# Altium schematic sheet Connector.SchDoc
size A4; SheetNumber: 3; SheetTotal: 3
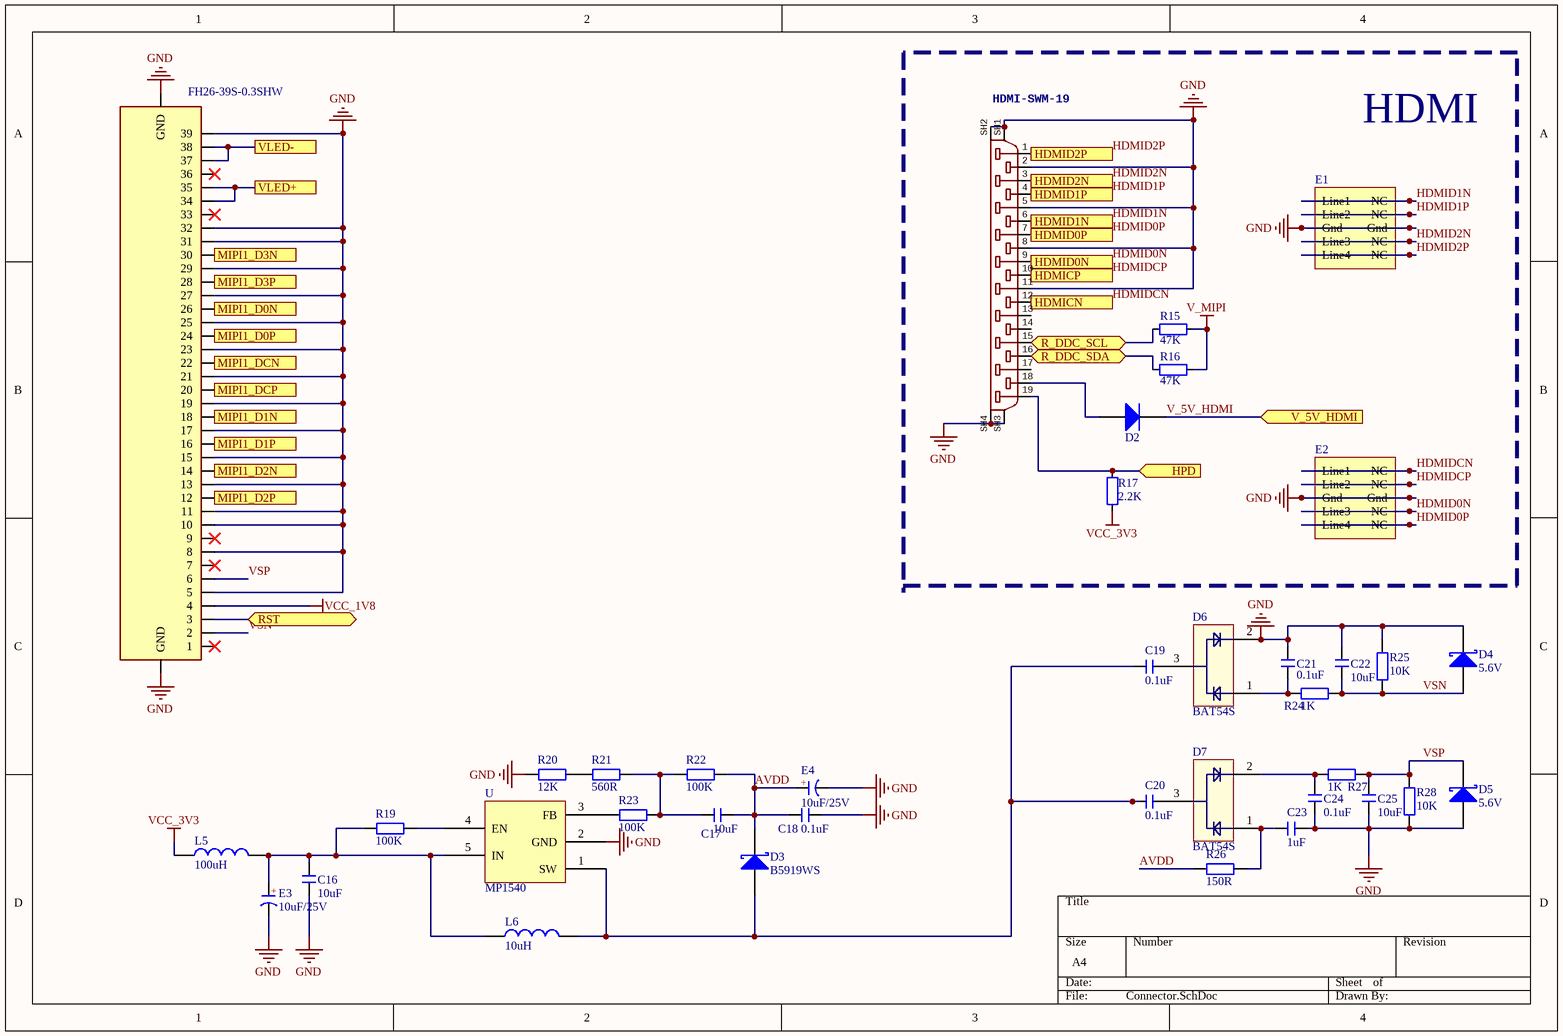
[diagram p0: Connector.SchDoc]

## Parts
2  FH26-39S-0.3SHW  [FH26-39S-0.3SHW]
C16  10uF  [C 0402_L]
C17  10uF  [C 0402_L]
C18  0.1uF  [C 0402_L]
C19  0.1uF  [C 0402_L]
C20  0.1uF  [C 0402_L]
C21  0.1uF  [C 0402_L]
C22  10uF  [C 0402_L]
C23  1uF  [C 0402_L]
C24  0.1uF  [C 0402_L]
C25  10uF  [C 0402_L]
D2  二极管-5B5817WS  [SOD-323]  (value not drawn)
D3  B5919WS  [DIODE-SMB]
D4  5.6V  [SOD-323]
D5  5.6V  [SOD-323]
D6  BAT54S  [SOT23]
D7  BAT54S  [SOT23]
E1  E?  [DFN-2510]  (value not drawn)
E2  E?  [DFN-2510]  (value not drawn)
E3  10uF/25V  [CD A(3216)]
E4  10uF/25V  [CD A(3216)]
HDMI?  HDMI-SWM-19  [HDMI-SWM-19]
L5  100uH  [L 0805]
L6  10uH  [L 0805]
R15  47K  [RES_0402]
R16  47K  [RES_0402]
R17  2.2K  [RES_0402]
R19  100K  [R 0402_L]
R20  12K  [R 0402_L]
R21  560R  [R 0402_L]
R22  100K  [R 0402_L]
R23  100K  [R 0402_L]
R24  1K  [R 0402_L]
R25  10K  [R 0402_L]
R26  150R  [R 0402_L]
R27  1K  [R 0402_L]
R28  10K  [R 0402_L]
U  MP1540  [SOT95P280X100-5N]

## Ports
HDMICN (out), HDMICP (out), HDMID0N (out), HDMID0P (out), HDMID1N (out), HDMID1P (out), HDMID2N (out), HDMID2P (out), HPD (in), MIPI1_D0N (in), MIPI1_D0P (in), MIPI1_D1N (in), MIPI1_D1P (in), MIPI1_D2N (in), MIPI1_D2P (in), MIPI1_D3N (in), MIPI1_D3P (in), MIPI1_DCN (in), MIPI1_DCP (in), R_DDC_SCL (bidir), R_DDC_SDA (bidir), RST (bidir), V_5V_HDMI (in), VLED+, VLED-

## Nets
GND: 2.5 2.8 2.10 2.11 2.13 2.15 2.17 2.19 2.21 2.23 2.25 2.27 2.29 2.31 2.32 2.39 2.GND1(GND) 2.GND2(GND) C16.1 C18.2 C21.1 C22.2 C23.1 C24.1 C25.1 D4.2(K) D5.1(A) D6.2 E1.3(Gnd) E1.8(Gnd) E2.3(Gnd) E2.8(Gnd) E3.2(K) E4.2(K) HDMI?.2 HDMI?.5 HDMI?.8 HDMI?.11 HDMI?.SH1 HDMI?.SH2 HDMI?.SH3 HDMI?.SH4 R20.1 R25.2 R28.1 U.2(GND)
V_MIPI: R15.2 R16.2
VCC_1V8: 2.4
VCC_3V3: L5.1 R17.1
AVDD: C17.2 C18.1 D3.2(K) E4.1(A) R22.2 R26.1
HDMID0N: E2.4(Line3) E2.7(NC) HDMI?.9 ; port HDMID0N
HDMID0P: E2.5(Line4) E2.6(NC) HDMI?.7 ; port HDMID0P
HDMID1N: E1.1(Line1) E1.10(NC) HDMI?.6 ; port HDMID1N
HDMID1P: E1.2(Line2) E1.9(NC) HDMI?.4 ; port HDMID1P
HDMID2N: E1.4(Line3) E1.7(NC) HDMI?.3 ; port HDMID2N
HDMID2P: E1.5(Line4) E1.6(NC) HDMI?.1 ; port HDMID2P
HDMIDCN: E2.1(Line1) E2.10(NC) HDMI?.12 ; port HDMICN
HDMIDCP: E2.2(Line2) E2.9(NC) HDMI?.10 ; port HDMICP
HPD: HDMI?.19 R17.2 ; port HPD
MIPI1_D0N: 2.26 ; port MIPI1_D0N
MIPI1_D0P: 2.24 ; port MIPI1_D0P
MIPI1_D1N: 2.18 ; port MIPI1_D1N
MIPI1_D1P: 2.16 ; port MIPI1_D1P
MIPI1_D2N: 2.14 ; port MIPI1_D2N
MIPI1_D2P: 2.12 ; port MIPI1_D2P
MIPI1_D3N: 2.30 ; port MIPI1_D3N
MIPI1_D3P: 2.28 ; port MIPI1_D3P
MIPI1_DCN: 2.22 ; port MIPI1_DCN
MIPI1_DCP: 2.20 ; port MIPI1_DCP
R_DDC_SCL: HDMI?.15 R15.1 ; port R_DDC_SCL
R_DDC_SDA: HDMI?.16 R16.1 ; port R_DDC_SDA
RST: 2.3 ; port RST
V_5V_HDMI: D2.2(K) ; port V_5V_HDMI
VLED+: 2.34 2.35 ; port VLED+
VLED-: 2.37 2.38 ; port VLED-
VSN: 2.2 C22.1 D4.1(A) R24.2 R25.1
VSP: 2.6 C25.2 D5.2(K) R27.2 R28.2
NetC16_2: C16.2 E3.1(A) L5.2 L6.1 R19.1 U.5(IN)
NetC17_1: C17.1 R21.2 R22.1 R23.2
NetC19_1: C19.1 C20.1 D3.1(A) L6.2 U.1(SW)
NetC19_2: C19.2 D6.3
NetC20_2: C20.2 D7.3
NetC21_2: C21.2 D6.1 R24.1
NetC23_2: C23.2 D7.1 R26.2
NetC24_2: C24.2 D7.2 R27.1
NetD2_1: D2.1(A) HDMI?.18
NetR19_2: R19.2 U.4(EN)
NetR20_2: R20.2 R21.1
NetR23_1: R23.1 U.3(FB)

Not connected (* = marked no-connect by the designer): 2 1* 7* 9* 33* 36*; HDMI? 13 14 17

## Notes on the sheet
- HDMI
- (in symbol CT) +

## Library data of the parts
2 = FH26-39S-0.3SHW: 39 Position FPC Connector Contacts, Bottom 0.012 _0.30mm_ Surface Mount, Right Angle; MF: Hirose; Package: None; Value: *; Availability: Unavailable; MP: FH26-39S-0.3SHW; SnapEDA_Link: https://www.snapeda.com/parts/FH26-39S-0.3SHW/Hirose/view-part/44187/?ref=snap; Price: None
C16-C25 = C: 贴片电容; BOM名称: 无极性贴片电容; 淘宝ID: 封装库来自淘宝 ID：黄晶宝石; 联系售后: https://shop463601444.taobao.com
D2 = 二极管-5B5817WS: 40V
D3-D5 = 1N5819: 肖特基二极管; 淘宝ID: 封装库来自淘宝 ID：黄晶宝石; 属性: 40V/2A; BOM名称: 肖特基二极管; 欢迎光临: https://shop463601444.taobao.com
D6 D7 = BAT54S: 两路肖特基二极管; pin to pad: 1>B 2>E 3>C
E1 E2 = AZ1045-04F
E3 E4 = CT: 贴片钽电容; 淘宝ID: 封装库来自淘宝 ID：黄晶宝石; BOM名称: 贴片钽电容; 联系售后: https://shop463601444.taobao.com
HDMI? = HDMI-MC34931HDMI-SWM-19
L5 L6 = L: 小功率贴片电感; 淘宝ID: 封装库来自淘宝 ID：黄晶宝石; BOM名称: 小功率贴片电感; 联系售后: https://shop463601444.taobao.com
R15-R17 = 电阻-0402: Resistor; Value: 22R
R19-R28 = R: 贴片电阻; 版权归属: 来自淘宝 ID：黄晶宝石; BOM名称: 贴片电阻; 联系售后: https://shop463601444.taobao.com